# Altium schematic sheet INDEX.SchDoc
size 420 x 297 mm; Date: 21/02/2025; Address1: BEE-PC1; SheetNumber: 1; SheetTotal: 4
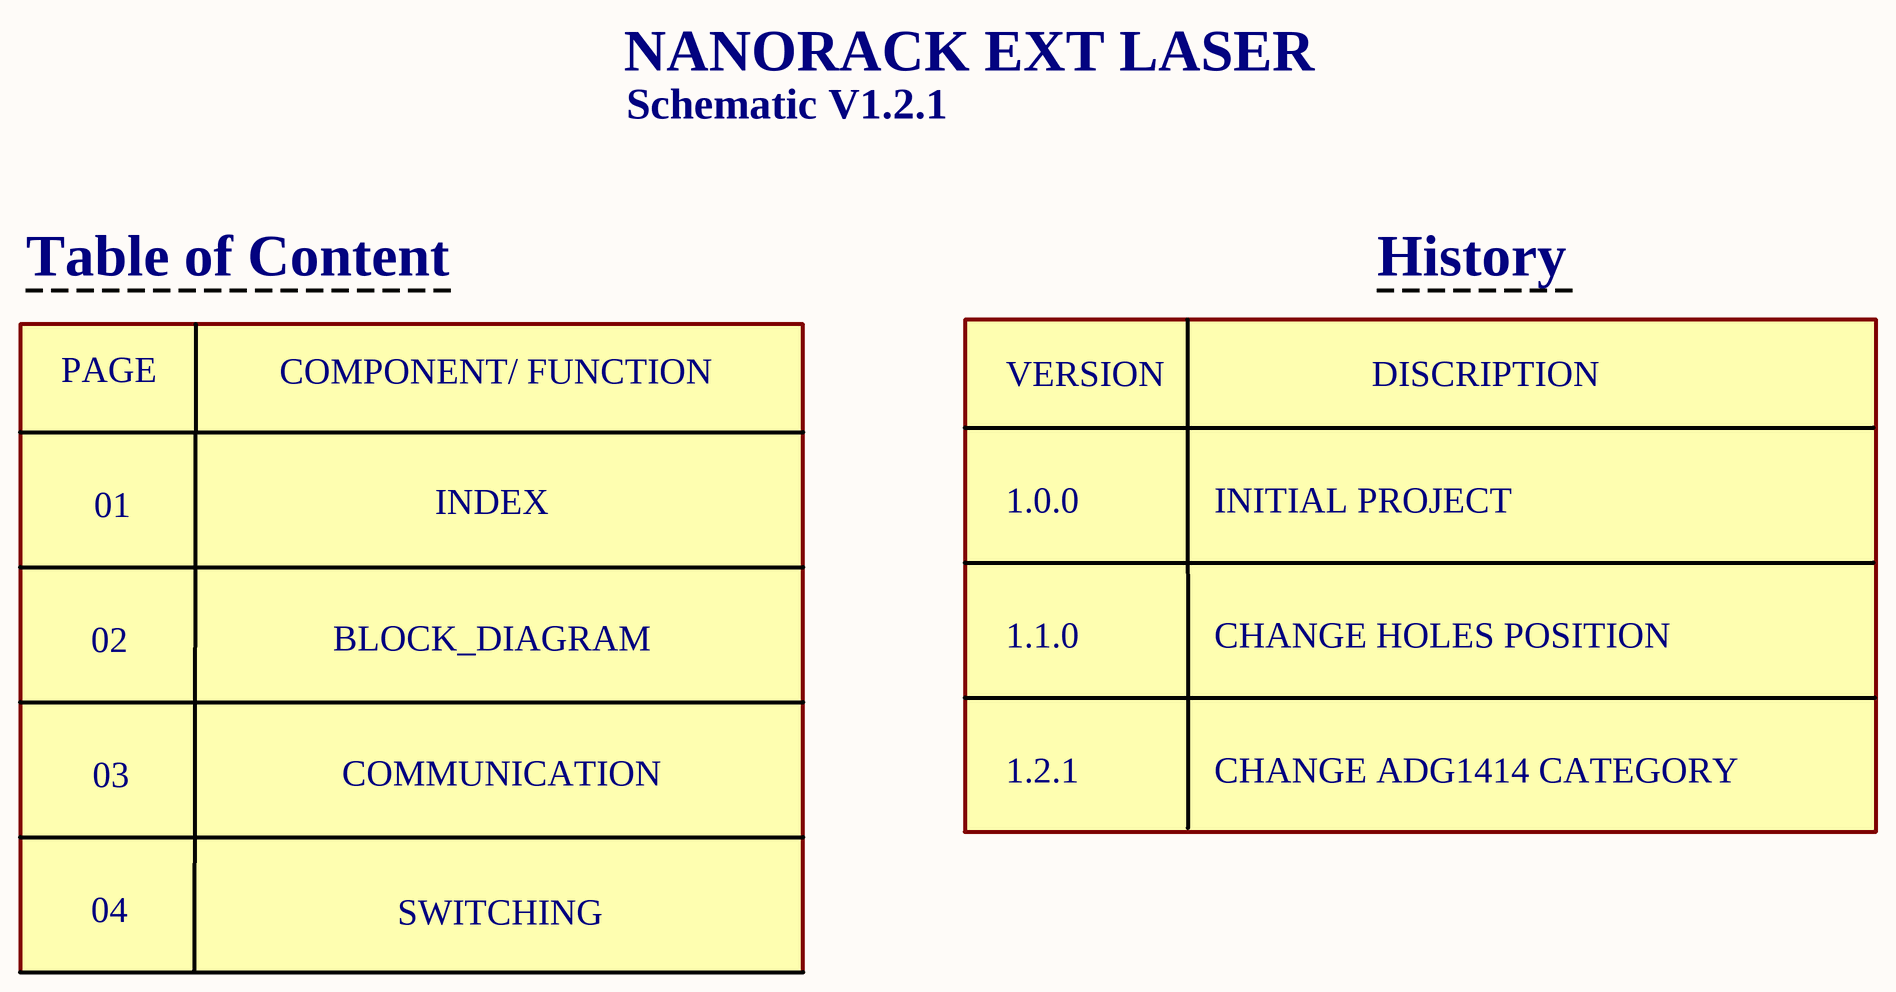
[diagram p0: INDEX.SchDoc]

## Notes on the sheet
- NANORACK EXT LASER
- Schematic V1.2.1
- Table of Content
- History
- PAGE
- COMPONENT/ FUNCTION
- VERSION
- DISCRIPTION
- 01
- INDEX
- 1.0.0
- INITIAL PROJECT
- 02
- BLOCK_DIAGRAM
- 1.1.0
- CHANGE HOLES POSITION
- 03
- COMMUNICATION
- 1.2.1
- CHANGE ADG1414 CATEGORY
- 04
- SWITCHING
- Project:
- BEE-PC1
- Sub-system:
- Design by:
- Hung Nguyen D.
- Bao Bui Q.
- Sheet title:
- Sheet
- A3
- of
- Checked by:
- Approved by:
- Vu Pham
- Revision:
- Document No:
- V1.2.1
- Size:
- Date: